# Altium schematic sheet Fan_Feedback.SchDoc
size A
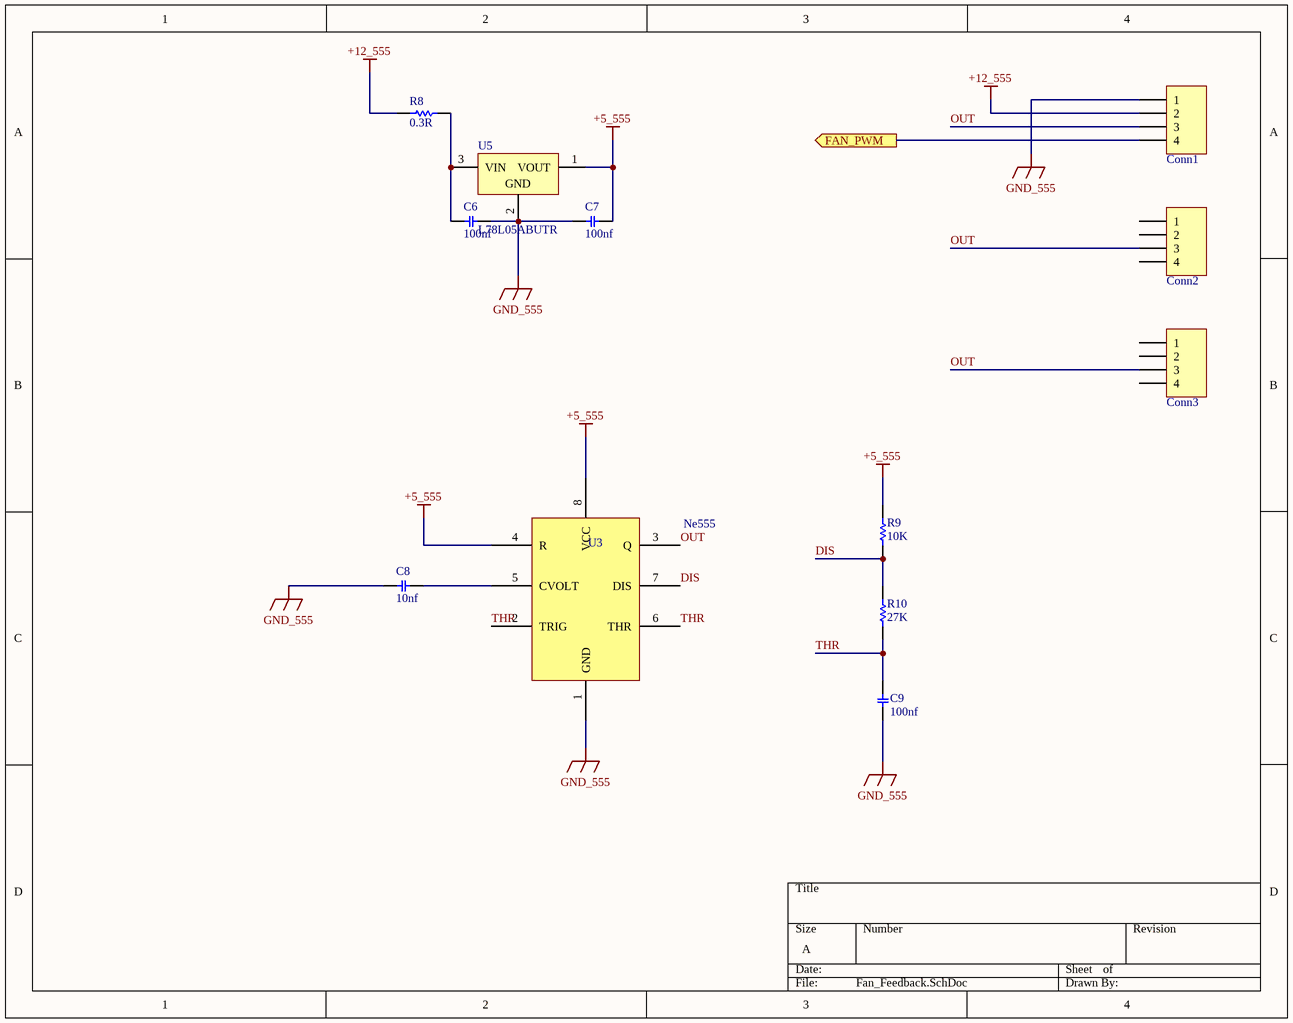
[diagram p0: Fan_Feedback.SchDoc]

## Parts
C6  value 100nf  [C1206]  (hidden comment: Capacitor C SMD 1206)
C7  value 100nf  [C1206]  (hidden comment: Capacitor C SMD 1206)
C8  value 10nf  [C1206]  (hidden comment: Capacitor C SMD 1206)
C9  value 100nf  [C1206]  (hidden comment: Capacitor C SMD 1206)
Conn1  Telecommunications_4pin  [Teleconn_4pin]  (value not drawn)
Conn2  Telecommunications_4pin  [Teleconn_4pin]  (value not drawn)
Conn3  Telecommunications_4pin  [Teleconn_4pin]  (value not drawn)
R8  value 0.3R  [SMD-1206-RES]  (hidden comment: Resistor SMD 1206)
R9  value 10K  [SMD-1206-RES]  (hidden comment: Resistor SMD 1206)
R10  value 27K  [SMD-1206-RES]  (hidden comment: Resistor SMD 1206)
U3  NE555  [NE555 SMD]
U5  L78L05ABUTR  [SOT-89_N]

## Ports
FAN_PWM (out)

## Nets
+5_555: C7.2 R9.2 U3.4(R) U3.8(VCC) U5.1(VOUT)
+12_555: Conn1.2 R8.1
GND_555: C6.2 C7.1 C8.1 C9.1 Conn1.1 U3.1(GND) U5.2(GND)
DIS: R9.1 R10.2 U3.7(DIS)
FAN_PWM: Conn1.4 ; port FAN_PWM
OUT: Conn1.3 Conn2.3 Conn3.3 U3.3(Q)
THR: C9.2 R10.1 U3.2(TRIG) U3.6(THR)
NetC6_1: C6.1 R8.2 U5.3(VIN)
NetC8_2: C8.2 U3.5(CVOLT)

Not connected (* = marked no-connect by the designer): Conn2 1 2 4; Conn3 1 2 4

## Library data of the parts
Conn1-Conn3 = Telecommunications_4pin: Telecommunications; ComponentLink1Description: Website Smart World; ComponentLink1URL: https://www.smartw.ir/; ComponentLink2Description: Telegram; ComponentLink2URL: https://t.me/altium_smartw; ComponentLink3Description: Instagram; ComponentLink3URL: https://Instagram.com/smartgw.ir; DatasheetVersion: 2021
U3 = NE555 2: ComponentLink1Description: Website Smart World; ComponentLink1URL: https://www.smartw.ir/; ComponentLink2Description: Telegram; ComponentLink2URL: https://t.me/altium_smartw; ComponentLink3Description: Instagram; ComponentLink3URL: https://Instagram.com/smartgw.ir; DatasheetVersion: 2021; Value: Ne555
U5 = CMP-0244-00406-1: Positive Voltage Regulator, 5V, 4-Pin SOT-89, Tape and Reel; PackageVersion: 2011; DatasheetVersion: 1/02/2011; PackageDescription: 3-Pin SOT-89 Package 1.5 mm Pitch, 4.1 mm Lead Span; PackageReference: SOT-89; ComponentLink2Description: Datasheet; ComponentLink1URL: http://www.st.com; ComponentLink1Description: Manufacturer URL; ComponentLink2URL: http://www.st.com/internet/com/TECHNICAL_RESOURCES/TECHNICAL_LITERATURE/DATASHEET/CD00000446.pdf
C6-C9 = Capacitor C SMD 1206: DatasheetVersion: 2021; ComponentLink1Description: Website Smart World; ComponentLink1URL: https://www.smartw.ir/; ComponentLink2Description: Telegram; ComponentLink2URL: https://t.me/altium_smartw; ComponentLink3Description: Instagram; ComponentLink3URL: https://Instagram.com/smartgw.ir
R8-R10 = Resistor SMD 1206: DatasheetVersion: 2021; ComponentLink1Description: Website Smart World; ComponentLink1URL: https://www.smartw.ir/; ComponentLink2Description: Telegram; ComponentLink2URL: https://t.me/altium_smartw; ComponentLink3Description: Instagram; ComponentLink3URL: https://Instagram.com/smartgw.ir